# EAGLE design Robotics Booster Pack (EAGLE 6.5.0)
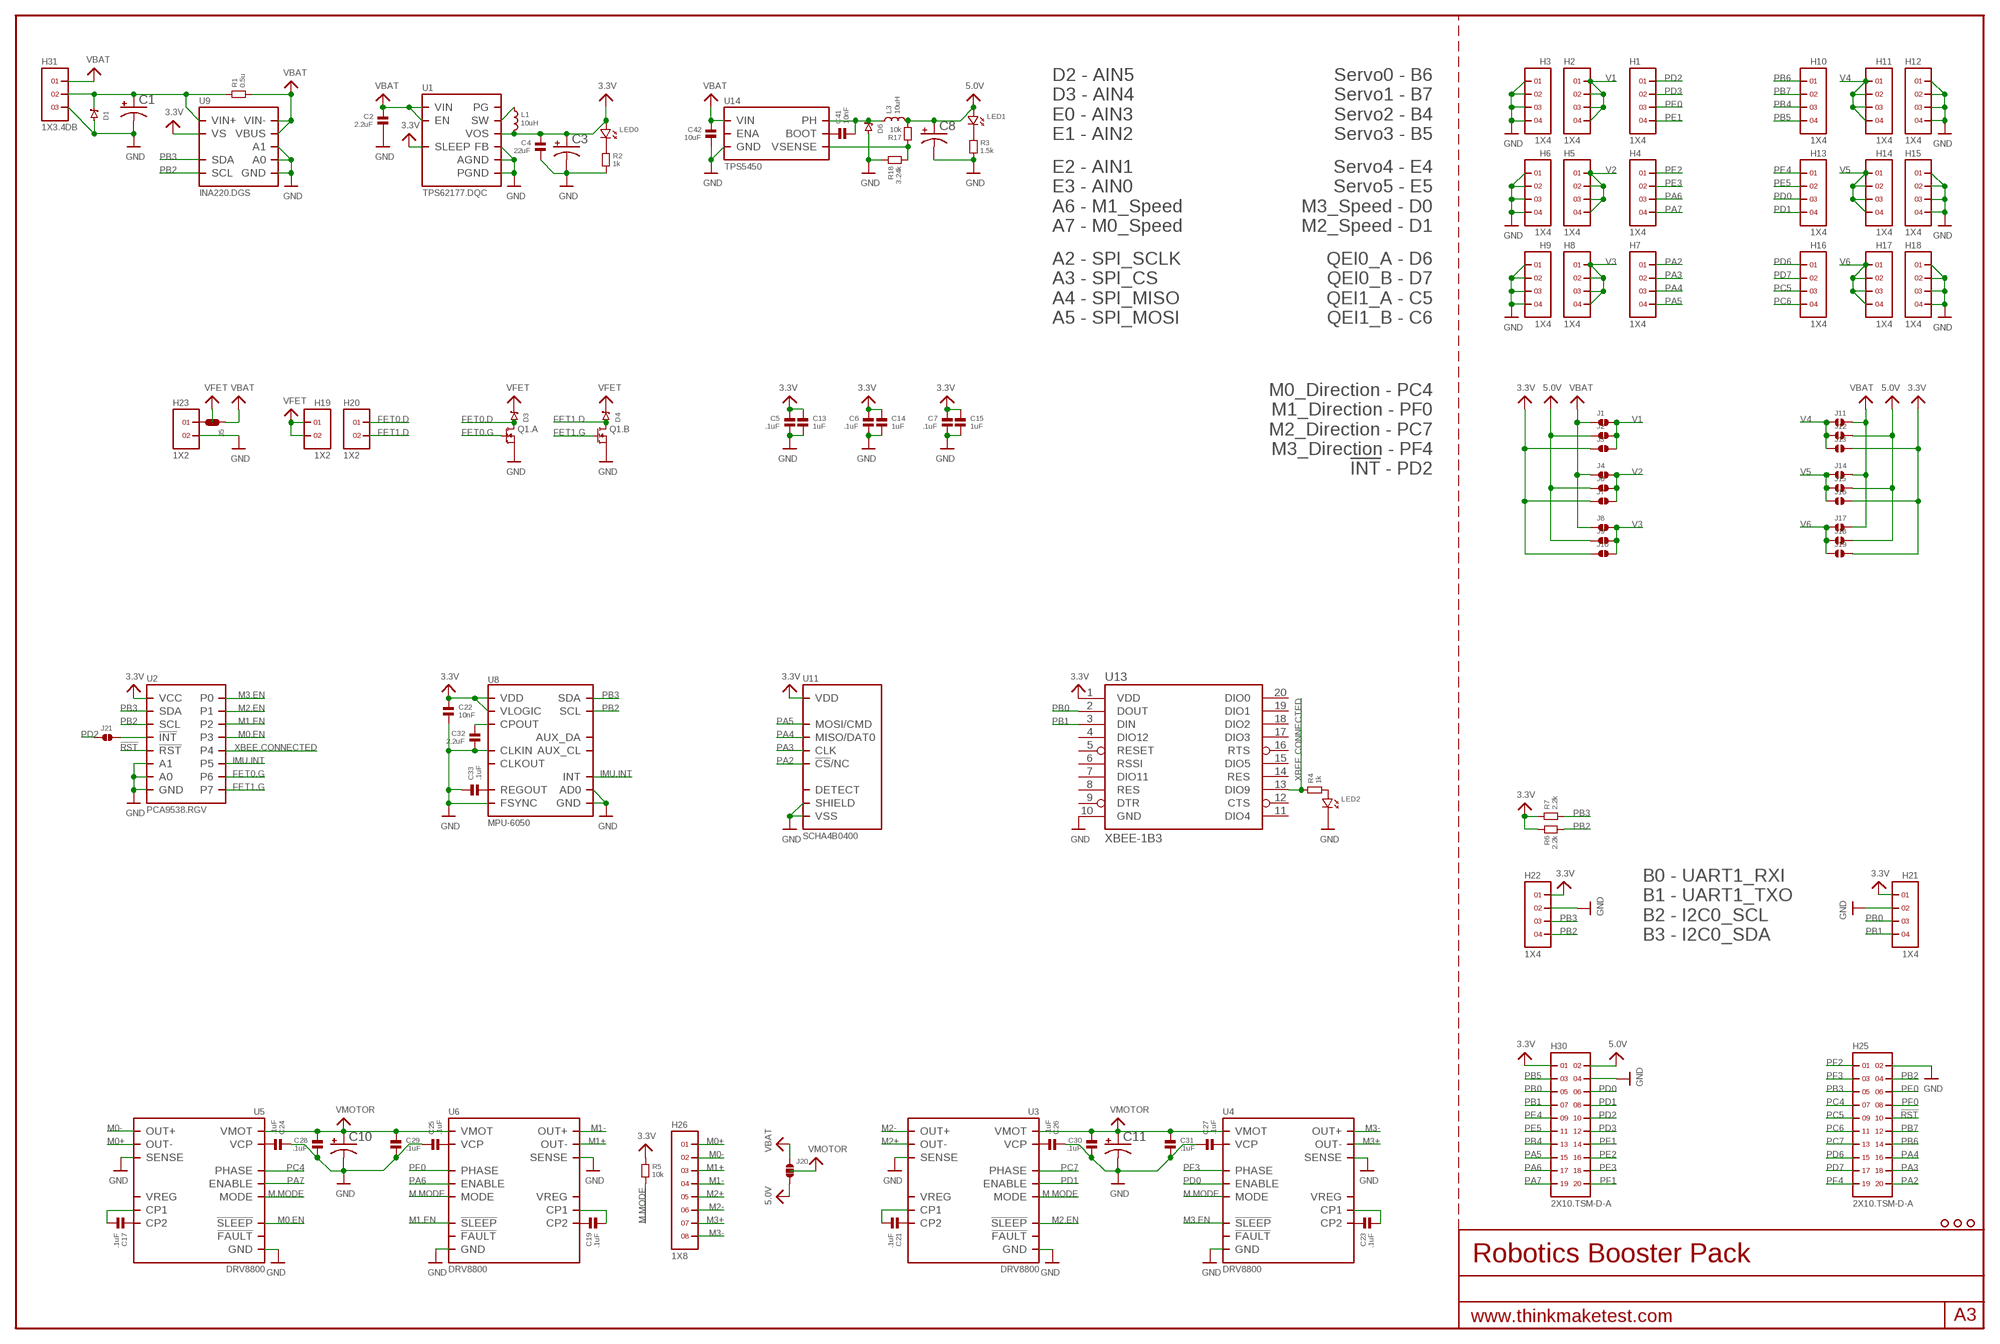
[diagram p0: schematic, sheet 1]

## Parts
C1  CPOL-USE  [PANASONIC_E]
C2  2.2uF  CAPACITOR.0603  [0603]
C3  CPOL-USE  [PANASONIC_E]
C4  22uF  CAPACITOR.0805  [0805]
C5  .1uF  CAPACITOR.0603  [0603]
C6  .1uF  CAPACITOR.0603  [0603]
C7  .1uF  CAPACITOR.0603  [0603]
C8  CPOL-USE  [PANASONIC_E]
C10  CPOL-USE  [PANASONIC_E]
C11  CPOL-USE  [PANASONIC_E]
C13  1uF  CAPACITOR.0603  [0603]
C14  1uF  CAPACITOR.0603  [0603]
C15  1uF  CAPACITOR.0603  [0603]
C17  .1uF  CAPACITOR.0603  [0603]
C19  .1uF  CAPACITOR.0603  [0603]
C21  .1uF  CAPACITOR.0603  [0603]
C22  10nF  CAPACITOR.0603  [0603]
C23  .1uF  CAPACITOR.0603  [0603]
C24  .1uF  CAPACITOR.0603  [0603]
C25  .1uF  CAPACITOR.0603  [0603]
C26  .1uF  CAPACITOR.0603  [0603]
C27  .1uF  CAPACITOR.0603  [0603]
C28  .1uF  CAPACITOR.0603  [0603]
C29  .1uF  CAPACITOR.0603  [0603]
C30  .1uF  CAPACITOR.0603  [0603]
C31  .1uF  CAPACITOR.0603  [0603]
C32  2.2uF  CAPACITOR.0603  [0603]
C33  .1uF  CAPACITOR.0603  [0603]
C41  10nF  CAPACITOR.0603  [0603]
C42  10uF  CAPACITOR.1206  [1206]
D1  CDBMT2100-HF  CDBMT____-HF  [SOD-123H]
D3  CDBMT2100-HF  CDBMT____-HF  [SOD-123H]
D4  CDBMT2100-HF  CDBMT____-HF  [SOD-123H]
D6  CDBC5XXX-G  [DO-214AB]
H1  1X4  [1X4]
H2  1X4  [1X4]
H3  1X4  [1X4]
H4  1X4  [1X4]
H5  1X4  [1X4]
H6  1X4  [1X4]
H7  1X4  [1X4]
H8  1X4  [1X4]
H9  1X4  [1X4]
H10  1X4  [1X4]
H11  1X4  [1X4]
H12  1X4  [1X4]
H13  1X4  [1X4]
H14  1X4  [1X4]
H15  1X4  [1X4]
H16  1X4  [1X4]
H17  1X4  [1X4]
H18  1X4  [1X4]
H19  1X2  [1X2]
H20  1X2  [1X2]
H21  1X4  [1X4]
H22  1X4  [1X4]
H23  1X2  [1X2]
H25  2X10.TSM-D-A  [TSM-110-XX-XXX-DV-A]
H26  1X8  [1824480000]
H30  2X10.TSM-D-A  [TSM-110-XX-XXX-DV-A]
H31  1X3.4DB  [4DB-P108-02]
J1  SOLDERJUMPER.2.LRG  [2.LRG]
J2  SOLDERJUMPER.2.LRG  [2.LRG]
J3  SOLDERJUMPER.2.LRG.PASTE  [2.LRG.PASTE]
J4  SOLDERJUMPER.2.LRG  [2.LRG]
J5  SOLDERJUMPER.3.LRG.12  [3.LRG.12]
J6  SOLDERJUMPER.2.LRG  [2.LRG]
J7  SOLDERJUMPER.2.LRG.PASTE  [2.LRG.PASTE]
J8  SOLDERJUMPER.2.LRG  [2.LRG]
J9  SOLDERJUMPER.2.LRG  [2.LRG]
J10  SOLDERJUMPER.2.LRG.PASTE  [2.LRG.PASTE]
J11  SOLDERJUMPER.2.LRG  [2.LRG]
J12  SOLDERJUMPER.2.LRG.PASTE  [2.LRG.PASTE]
J13  SOLDERJUMPER.2.LRG  [2.LRG]
J14  SOLDERJUMPER.2.LRG  [2.LRG]
J15  SOLDERJUMPER.2.LRG  [2.LRG]
J16  SOLDERJUMPER.2.LRG.PASTE  [2.LRG.PASTE]
J17  SOLDERJUMPER.2.LRG  [2.LRG]
J18  SOLDERJUMPER.2.LRG  [2.LRG]
J19  SOLDERJUMPER.2.LRG.PASTE  [2.LRG.PASTE]
J20  SOLDERJUMPER.3.LRG.12  [3.LRG.12]
J21  SOLDERJUMPER.2.LRG  [2.LRG]
L1  10uH  INDUCTOR-SRN6045  [SRN6045]
L3  10uH  INDUCTOR.XAL6060  [XAL6060]
LED0  LED.0603  [0603.LED]
LED1  LED.0603  [0603.LED]
LED2  LED.0603  [0603.LED]
Q1  FDMA  [MICROFET.2X2]
R1  0.5u  RESISTOR.2512  [2512]
R2  1k  RESISTOR.0603  [0603]
R3  1.5k  RESISTOR.0603  [0603]
R4  1k  RESISTOR.0603  [0603]
R5  10k  RESISTOR.0603  [0603]
R6  2.2k  RESISTOR.0603  [0603]
R7  2.2k  RESISTOR.0603  [0603]
R17  10k  RESISTOR.0603  [0603]
R18  3.24k  RESISTOR.0603  [0603]
U1  TPS62177.DQC  [DQC]
U2  PCA9538.RGV  [RGV.16]
U3  DRV8800  DRV8800.RTY  [RTY.16]
U4  DRV8800  DRV8800.RTY  [RTY.16]
U5  DRV8800  DRV8800.RTY  [RTY.16]
U6  DRV8800  DRV8800.RTY  [RTY.16]
U8  MPU-6050  [QFN.24.4X4]
U9  INA220.DGS  [DGS.10]
U11  SCHA4B0400  [SCHA4B0400]
U13  XBEE-1B3  [XBEE-SMD]
U14  TPS5450  TPS54X0  [DDA]
U$3  HOLE.4MM  [#4]
U$4  HOLE.4MM  [#4]
U$21  HOLE.4MM  [#4]

## Nets
3.3V: C3.+ C4.1 C5.1 C6.1 C7.1 C13.1 C14.1 C15.1 C22.1 H21.1 H22.1 H30.1 J3.1 J7.1 J10.1 J13.1 J16.1 J19.1 L1.2 LED0.P$1 R5.1 R6.1 R7.1 U1.8(SLEEP) U1.10(VOS) U2.14(VCC) U8.8(VLOGIC) U8.13(VDD) U9.6(VS) U11.VDD U13.1(VDD)
5.0V: C8.+ H30.2 J2.1 J6.1 J9.1 J12.1 J15.1 J18.1 J20.3 L3.2 LED1.P$1 R17.2
!RST: H25.10 U2.1(!RST)
FET0.D: D3.2 H20.1 Q1.6(.A:D) Q1.PAD@1(.A:D)
FET0.G: Q1.2(.A:G) U2.9(P6)
FET1.D: D4.2 H20.2 Q1.3(.B:D) Q1.PAD@2(.B:D)
FET1.G: Q1.5(.B:G) U2.10(P7)
GND: C1.- C2.2 C3.- C4.2 C5.2 C6.2 C7.2 C8.- C10.- C11.- C13.2 C14.2 C15.2 C22.2 C24.1 C25.1 C26.1 C27.1 C28.2 C29.2 C30.2 C31.2 C32.2 C33.1 C42.2 D1.2 D6.2 H3.1 H3.2 H3.3 H3.4 H6.1 H6.2 H6.3 H6.4 H9.1 H9.2 H9.3 H9.4 H12.1 H12.2 H12.3 H12.4 H15.1 H15.2 H15.3 H15.4 H18.1 H18.2 H18.3 H18.4 H21.2 H22.2 H23.2 H25.2 H30.4 H31.3 LED2.P$2 Q1.1(.A:S) Q1.4(.B:S) R2.2 R3.2 R18.1 U1.1(PGND) U1.5(FB) U1.6(AGND) U1.PAD(PGND) U2.6(GND) U2.15(A0) U2.16(A1) U2.PAD(GND) U3.2(GND) U3.7(SENSE) U3.12(GND) U3.PAD(GND) U4.2(GND) U4.7(SENSE) U4.12(GND) U4.PAD(GND) U5.2(GND) U5.7(SENSE) U5.12(GND) U5.PAD(GND) U6.2(GND) U6.7(SENSE) U6.12(GND) U6.PAD(GND) U8.1(CLKIN) U8.9(AD0) U8.11(FSYNC) U8.18(GND) U9.1(A1) U9.2(A0) U9.7(GND) U11.GND(VSS) U11.GND@1(VSS) U11.GND@2(VSS) U11.SHIELD U11.SHIELD@1(SHIELD) U11.SHIELD@2(SHIELD) U11.SHIELD@3(SHIELD) U11.VSS U13.10(GND) U14.6(GND) U14.PAD(GND)
IMU.INT: U2.8(P5) U8.12(INT)
M0+: H26.1@1 H26.1@2 U5.9(OUT-)
M0-: H26.2@1 H26.2@2 U5.6(OUT+)
M0.EN: U2.5(P3) U5.3(!SLEEP)
M1+: H26.3@1 H26.3@2 U6.9(OUT-)
M1-: H26.4@1 H26.4@2 U6.6(OUT+)
M1.EN: U2.4(P2) U6.3(!SLEEP)
M2+: H26.5@1 H26.5@2 U3.9(OUT-)
M2-: H26.6@1 H26.6@2 U3.6(OUT+)
M2.EN: U2.3(P1) U3.3(!SLEEP)
M3+: H26.7@1 H26.7@2 U4.9(OUT-)
M3-: H26.8@1 H26.8@2 U4.6(OUT+)
M3.EN: U2.2(P0) U4.3(!SLEEP)
M.MODE: R5.2 U3.16(MODE) U4.16(MODE) U5.16(MODE) U6.16(MODE)
N$1: L1.1 U1.9(SW)
N$2: LED0.P$2 R2.1
N$3: LED1.P$2 R3.1
N$4: LED2.P$1 R4.2
N$5: H23.1 J5.3
N$7: C33.2 U8.10(REGOUT)
N$8: J21.2 U2.11(!INT)
N$13: C17.1 U5.11(CP2)
N$18: C24.2 U5.13(VCP)
N$19: C25.2 U6.13(VCP)
N$20: C26.2 U3.13(VCP)
N$21: C27.2 U4.13(VCP)
N$22: C1.+ D1.1 H31.2 R1.1 U9.10(VIN+)
N$24: C32.1 U8.20(CPOUT)
N$25: C19.1 U6.11(CP2)
N$27: C21.1 U3.11(CP2)
N$29: C23.1 U4.11(CP2)
N$33: C41.1 U14.1(BOOT)
N$34: C41.2 D6.1 L3.1 U14.8(PH)
N$35: R17.1 R18.2 U14.4(VSENSE)
N$37: C21.2 U3.10(CP1)
N$38: C17.2 U5.10(CP1)
N$39: C19.2 U6.10(CP1)
N$40: C23.2 U4.10(CP1)
PA2: H7.1 H25.20 U11.!CS!/NC/DAT3(!CS!/NC)
PA3: H7.2 H25.18 U11.CLK
PA4: H7.3 H25.16 U11.MISO/DAT0
PA5: H7.4 H30.15 U11.MOSI/CMD
PA6: H4.3 H30.17 U6.4(ENABLE)
PA7: H4.4 H30.19 U5.4(ENABLE)
PB0: H21.3 H30.5 U13.2(DOUT)
PB1: H21.4 H30.7 U13.3(DIN)
PB2: H22.4 H25.4 R6.2 U2.12(SCL) U8.23(SCL) U9.5(SCL)
PB3: H22.3 H25.5 R7.2 U2.13(SDA) U8.24(SDA) U9.4(SDA)
PB4: H10.3 H30.13
PB5: H10.4 H30.3
PB6: H10.1 H25.14
PB7: H10.2 H25.12
PC4: H25.7 U5.1(PHASE)
PC5: H16.3 H25.9
PC6: H16.4 H25.11
PC7: H25.13 U3.1(PHASE)
PD0: H13.3 H30.6 U4.4(ENABLE)
PD1: H13.4 H30.8 U3.4(ENABLE)
PD2: H1.1 H30.10 J21.1
PD3: H1.2 H30.12
PD6: H16.1 H25.15
PD7: H16.2 H25.17
PE0: H1.3 H25.6
PE1: H1.4 H30.14
PE2: H4.1 H30.16
PE3: H4.2 H30.18
PE4: H13.1 H30.9
PE5: H13.2 H30.11
PF0: H25.8 U6.1(PHASE)
PF1: H30.20
PF2: H25.1
PF3: H25.3 U4.1(PHASE)
PF4: H25.19
V1: H2.1 H2.2 H2.3 H2.4 J1.2 J2.2 J3.2
V2: H5.1 H5.2 H5.3 H5.4 J4.2 J6.2 J7.2
V3: H8.1 H8.2 H8.3 H8.4 J8.2 J9.2 J10.2
V4: H11.1 H11.2 H11.3 H11.4 J11.2 J12.2 J13.2
V5: H14.1 H14.2 H14.3 H14.4 J14.2 J15.2 J16.2
V6: H17.1 H17.2 H17.3 H17.4 J17.2 J18.2 J19.2
VBAT: C2.1 C42.1 H31.1 J1.1 J4.1 J5.1 J8.1 J11.1 J14.1 J17.1 J20.1 R1.2 U1.2(VIN) U1.3(EN) U9.8(VBUS) U9.9(VIN-) U14.7(VIN)
VFET: D3.1 D4.1 H19.1 H19.2 J5.2
VMOTOR: C10.+ C11.+ C28.1 C29.1 C30.1 C31.1 J20.2 U3.8(VMOT) U4.8(VMOT) U5.8(VMOT) U6.8(VMOT)
XBEE.CONNECTED: R4.1 U2.7(P4) U13.13(DIO9)
Unconnected: U1.7(PG) U3.14(VREG) U3.15(!FAULT) U4.14(VREG) U4.15(!FAULT) U5.14(VREG) U5.15(!FAULT) U6.14(VREG) U6.15(!FAULT) U8.6(AUX_DA) U8.7(AUX_CL) U8.22(CLKOUT) U11.CD(DETECT) U13.4(DIO12) U13.5(RESET) U13.6(RSSI) U13.7(DIO11) U13.8(RES) U13.9(DTR) U13.11(DIO4) U13.12(CTS) U13.14(RES) U13.15(DIO5) U13.16(RTS) U13.17(DIO3) U13.18(DIO2) U13.19(DIO1) U13.20(DIO0) U14.5(ENA)

## Notes on the sheet
- D2 - AIN5
  D3 - AIN4
  E0 - AIN3
  E1 - AIN2
- Servo0 - B6
  Servo1 - B7
  Servo2 - B4
  Servo3 - B5
- E2 - AIN1
  E3 - AIN0
  A6 - M1_Speed
  A7 - M0_Speed
- Servo4 - E4
  Servo5 - E5
  M3_Speed - D0
  M2_Speed - D1
- A2 - SPI_SCLK
  A3 - SPI_CS
  A4 - SPI_MISO
  A5 - SPI_MOSI
- QEI0_A - D6
  QEI0_B - D7
  QEI1_A - C5
  QEI1_B - C6
- M0_Direction - PC4
  M1_Direction - PF0
  M2_Direction - PC7
  M3_Direction - PF4
  !INT! - PD2
- B0 - UART1_RXI
  B1 - UART1_TXO
  B2 - I2C0_SCL
  B3 - I2C0_SDA

## Library data of the parts
C1 C3 C8 C10 C11 = adafruit:CPOL-US: POLARIZED CAPACITOR, American symbol
C2 C4-C7 C13-C15 C17 C19 C21-C33 C41 C42 = standardparts:CAPACITOR
D1 D3 D4 = comchip:CDBMT____-HF
D6 = comchip:CDBC5XXX-G
H1-H18 H21 H22 = headers(.1in):1X4
H19 H20 H23 = headers(.1in):1X2
H25 H30 = headers(.1in)(samtec):2X10
H26 = weidmuller:1X8
H31 = te-connectivity:1X3
J1-J4 J6-J19 J21 = solderjumper:SOLDERJUMPER.2
J5 J20 = solderjumper:SOLDERJUMPER.3
L1 = bourns:INDUCTOR
L3 = coilcraft:INDUCTOR
LED0 LED1 LED2 = standardparts:LED
Q1 = fairchild:FDMA
R1 = tt-electronics:RESISTOR
R2-R7 R17 R18 = standardparts:RESISTOR
U1 = packages(ti):TPS62177
U2 = packages(ti):PCA9538
U3-U6 = packages(ti):DRV8800
U8 = invensense:MPU-6050
U9 = packages(ti):INA220
U11 = alps:SCHA4B0400
U13 = SparkFun-RF:XBEE-1: Xbee module footprints SMT header is CONN-09042.; PROD_ID: CONN-09042
U14 = packages(ti):TPS54X0
U$3 U$4 U$21 = screw_holes:HOLE

## Board
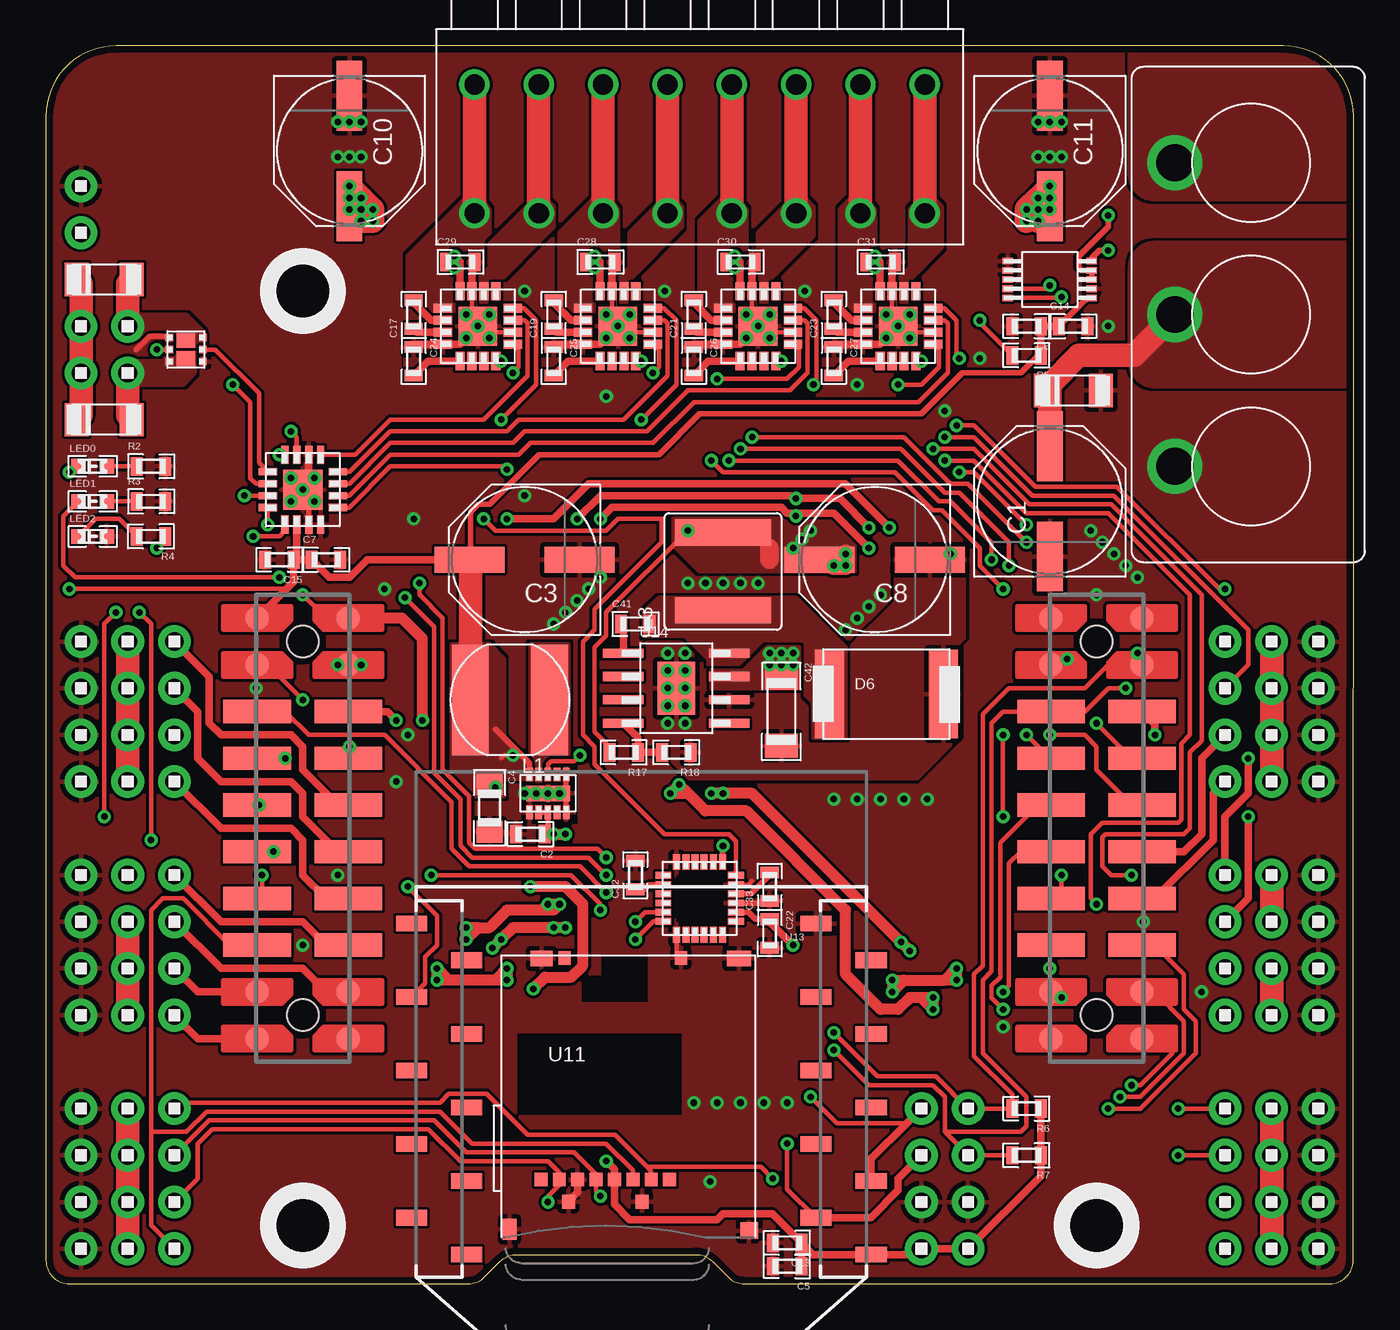
[diagram p1: board, top side]
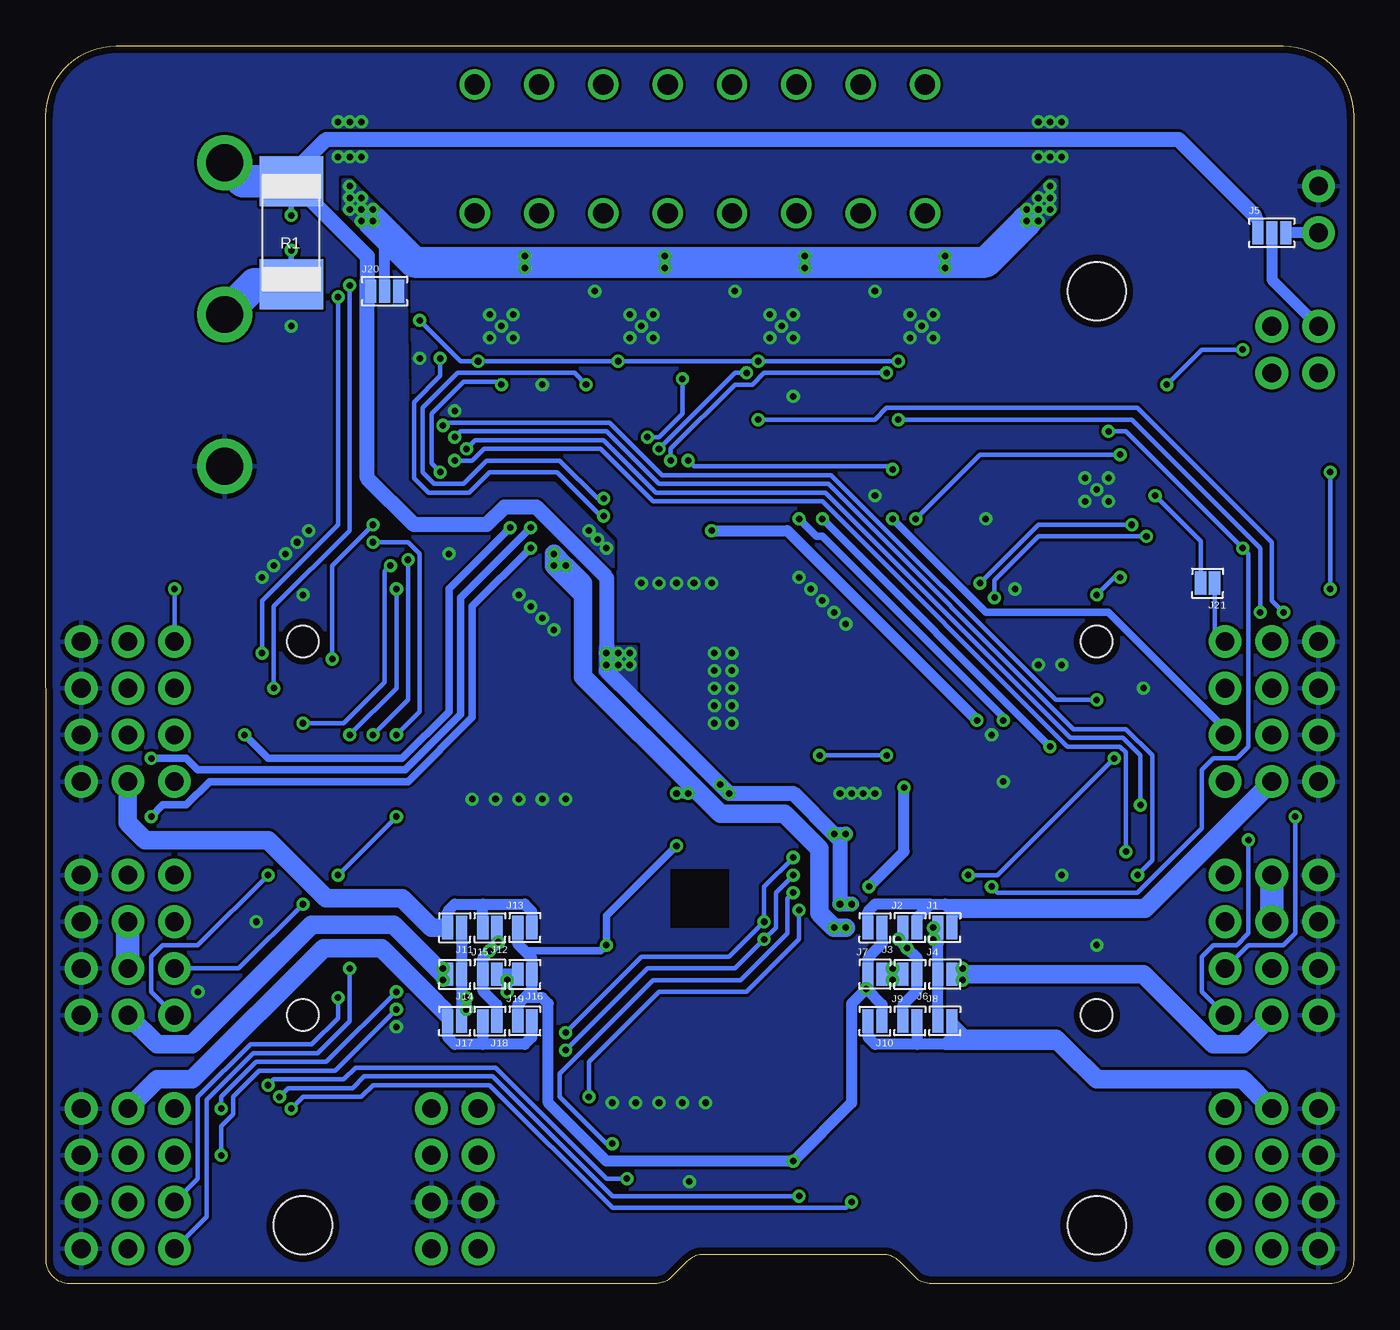
[diagram p2: board, bottom side, seen from below]

Size 71.13 x 67.31 mm. Coordinates in mm from the lower left corner, seen from the top.
Outline: 71.12,1.26 71.13,63.51 arc90 67.32,67.31 3.81,67.31 arc91 0,63.5 0,1.27 arc90 1.27,0 22.97,0 arc45 23.87,0.37 24.71,1.22 arc-45 25.61,1.59 35.35,1.59 arc-45 36.25,1.22 37.09,0.37 arc45 37.99,0 69.85,0 arc90 71.12,1.26
Copper layers (1*16): Top 0.0356mm / dielectric 1.5011mm / Bottom 0.0356mm
Design rules "OSHPark": minimum track width 6mil, minimum drill 13mil, track to track 6mil, track to pad 6mil, pad to pad 6mil, via to via 6mil, smd to smd 6mil, copper to edge 15mil, drill to drill 6mil, minimum pad ring 7mil, minimum via ring 7mil, stop-mask expansion 4mil, vias tented up to drill 16mil, thermal gap 10mil
tKeepout: 1 lines
tRestrict: area 34.3,19.7 to 36.8,22.2; 13 lines
bRestrict: area 34,19.4 to 37.1,22.5

### Footprints (pad centres in the part's own frame; a part is rotated, then mirrored left to right if it is on the bottom)
PANASONIC_E = smd 3.8 x 1.4: + 3,0; - -3,0
0603 = smd 0.65 x 1: 1 -0.775,0; 2 0.775,0
0805 = smd 1.2 x 1.4: 1 -1.3,0; 2 1.3,0
1206 = smd 1.3 x 1.8: 1 -1.85,0; 2 1.85,0
SOD-123H = smd 1.3 x 1.8: 1 -1.5,0; 2 1.5,0
DO-214AB = smd 1.6 x 4.8: 1 -3.1,0; 2 3.1,0
1X4 = drill 1.016 pad 1.778: 1 0,0; 2 2.54,0; 3 5.08,0; 4 7.62,0
1X2 = drill 1.016 pad 1.778: 1 0,0; 2 2.54,0
TSM-110-XX-XXX-DV-A = smd 1.27 x 1.27: 1 -11.43,-2.477; 2 -11.43,2.477; 3 -8.89,-2.477; 4 -8.89,2.477; 17 8.89,-2.477; 18 8.89,2.477; 19 11.43,-2.477; 20 11.43,2.477 | smd 1.27 x 3.683: 5 -6.35,-2.477; 6 -6.35,2.477; 7 -3.81,-2.477; 8 -3.81,2.477; 9 -1.27,-2.477; 10 -1.27,2.477; 11 1.27,-2.477; 12 1.27,2.477; 13 3.81,-2.477; 14 3.81,2.477; 15 6.35,-2.477; 16 6.35,2.477 | hole 1.727: -10.16,0; 10.16,0
1824480000 = drill 1.1: 1@1 -12.25,8.7; 1@2 -12.25,1.7; 2@1 -8.75,8.7; 2@2 -8.75,1.7; 3@1 -5.25,8.7; 3@2 -5.25,1.7; 4@1 -1.75,8.7; 4@2 -1.75,1.7; 5@1 1.75,8.7; 5@2 1.75,1.7; 6@1 5.25,8.7; 6@2 5.25,1.7; 7@1 8.75,8.7; 7@2 8.75,1.7; 8@1 12.25,8.7; 8@2 12.25,1.7
4DB-P108-02 = drill 2: 1 -8.255,2.362; 2 0,2.362; 3 8.255,2.362
2.LRG = smd 0.61 x 1.27: 1 -0.381,0; 2 0.381,0
2.LRG.PASTE = smd 0.61 x 1.27: 1 -0.381,0; 2 0.381,0
3.LRG.12 = smd 0.61 x 1.27: 1 -0.762,0; 2 0,0; 3 0.762,0
SRN6045 = smd 2 x 6: 1 -2.15,0; 2 2.15,0
XAL6060 = smd 1.43 x 5.24: 1 -2.11,0; 2 2.11,0
0603.LED = smd 0.8 x 0.8: P$1 -0.775,0; P$2 0.775,0
MICROFET.2X2 = smd 0.42 x 0.42: 1 -0.65,-0.915; 2 0,-0.915; 3 0.65,-0.915; 4 0.65,0.915; 5 0,0.915; 6 -0.65,0.915 | smd 0.8 x 1: PAD@1 -0.5,0; PAD@2 0.5,0
2512 = smd 2.7 x 3.45: 1 -2.8,0; 2 2.8,0
DQC = smd 0.75 x 0.37: 1 -1.025,1; 2 -1.025,0.5; 3 -1.025,0; 4 -1.025,-0.5; 5 -1.025,-1; 6 1.025,-1; 7 1.025,-0.5; 8 1.025,0; 9 1.025,0.5; 10 1.025,1 | smd 0.84 x 2.4: PAD 0,0
RGV.16 = smd 1 x 0.4: 1 -1.9,0.975; 2 -1.9,0.325; 3 -1.9,-0.325; 4 -1.9,-0.975; 9 1.9,-0.975; 10 1.9,-0.325; 11 1.9,0.325; 12 1.9,0.975 | smd 0.4 x 1: 5 -0.975,-1.9; 6 -0.325,-1.9; 7 0.325,-1.9; 8 0.975,-1.9; 13 0.975,1.9; 14 0.325,1.9; 15 -0.325,1.9; 16 -0.975,1.9 | smd 2.16 x 2.16: PAD 0,0
RTY.16 = smd 1 x 0.5: 1 -1.9,0.975; 2 -1.9,0.325; 3 -1.9,-0.325; 4 -1.9,-0.975; 9 1.9,-0.975; 10 1.9,-0.325; 11 1.9,0.325; 12 1.9,0.975 | smd 0.5 x 1: 5 -0.975,-1.9; 6 -0.325,-1.9; 7 0.325,-1.9; 8 0.975,-1.9; 13 0.975,1.9; 14 0.325,1.9; 15 -0.325,1.9; 16 -0.975,1.9 | smd 2.1 x 2.1: PAD 0,0
QFN.24.4X4 = smd 0.85 x 0.38: 1 -1.975,1.25; 2 -1.975,0.75; 3 -1.975,0.25; 4 -1.975,-0.25; 5 -1.975,-0.75; 6 -1.975,-1.25; 13 1.975,-1.25; 14 1.975,-0.75; 15 1.975,-0.25; 16 1.975,0.25; 17 1.975,0.75; 18 1.975,1.25 | smd 0.38 x 0.85: 7 -1.25,-1.975; 8 -0.75,-1.975; 9 -0.25,-1.975; 10 0.25,-1.975; 11 0.75,-1.975; 12 1.25,-1.975; 19 1.25,1.975; 20 0.75,1.975; 21 0.25,1.975; 22 -0.25,1.975; 23 -0.75,1.975; 24 -1.25,1.975
DGS.10 = smd 0.36 x 0.57: 1 -1,-2.285; 2 -0.5,-2.285; 3 0,-2.285; 4 0.5,-2.285; 5 1,-2.285; 6 1,2.285; 7 0.5,2.285; 8 0,2.285; 9 -0.5,2.285; 10 -1,2.285
SCHA4B0400 = smd 0.7 x 0.75: !CS!/NC/DAT3 8.162,3.125; CLK 5.162,3.125; GND 3.663,1.925; GND@1 7.662,1.925; MISO/DAT0 3.163,3.125; MOSI/CMD 7.162,3.125; NC/NC/DAT1 2.163,3.125; NC/NC/DAT2 9.162,3.125; VDD 6.162,3.125; VSS 4.162,3.125 | smd 0.65 x 0.75: CD 3.438,15.175; GND@2 9.787,15.175 | smd 0.745 x 1.15: SHIELD 0.453,0.425 | smd 0.95 x 0.9: SHIELD@1 13.488,0.35 | smd 1.3 x 0.85: SHIELD@2 12.925,15.15 | smd 1.2 x 0.85: SHIELD@3 2.2,15.15
XBEE-SMD = smd 1.7 x 0.85: 1 -12.5,20; 2 -9.5,18; 3 -12.5,16; 4 -9.5,14; 5 -12.5,12; 6 -9.5,10; 7 -12.5,8; 8 -9.5,6; 9 -12.5,4; 10 -9.5,2; 11 12.5,2; 12 9.5,4; 13 12.5,6; 14 9.5,8; 15 12.5,10; 16 9.5,12; 17 12.5,14; 18 9.5,16; 19 12.5,18; 20 9.5,20
DDA = smd 2.2 x 0.5: 1 -2.875,1.905; 2 -2.875,0.635; 3 -2.875,-0.635; 4 -2.875,-1.905; 5 2.875,-1.905; 6 2.875,-0.635; 7 2.875,0.635; 8 2.875,1.905 | smd 2.05 x 2.875: PAD 0,0
#4 = hole 3.175: 0,0

### Placement (x,y rotation side)
C1  54.61,42.55 90 top
C2  26.35,24.45 180 top
C3  26.04,39.37 180 top
C4  24.13,25.88 270 top
C5  40.32,0.95 180 top
C6  53.34,52.07 180 top
C7  15.24,39.37 0 top
C8  45.09,39.37 180 top
C10  16.51,61.59 270 top
C11  54.61,61.59 270 top
C13  40.32,2.22 180 top
C14  55.88,52.07 0 top
C15  12.7,39.37 180 top
C17  20,52.7 90 top
C19  27.62,52.7 90 top
C21  35.24,52.7 90 top
C22  39.37,19.05 270 top
C23  42.86,52.7 90 top
C24  20,50.16 270 top
C25  27.62,50.16 270 top
C26  35.24,50.16 270 top
C27  42.86,50.16 270 top
C28  30.16,55.56 0 top
C29  22.54,55.56 0 top
C30  37.78,55.56 0 top
C31  45.4,55.56 0 top
C32  32.07,22.23 90 top
C33  39.37,21.59 90 top
C41  32.07,35.88 0 top
C42  40.01,31.11 270 top
D1  55.88,48.58 0 top
D3  3.17,46.99 0 top
D4  3.17,54.61 0 top
D6  45.72,32.07 0 top
H1  6.99,34.92 270 top
H2  4.45,34.92 270 top
H3  1.91,34.92 270 top
H4  6.99,22.23 270 top
H5  4.45,22.23 270 top
H6  1.91,22.23 270 top
H7  6.99,9.53 270 top
H8  4.45,9.53 270 top
H9  1.91,9.53 270 top
H10  64.14,27.3 90 top
H11  66.67,27.3 90 top
H12  69.22,27.3 90 top
H13  64.14,14.61 90 top
H14  66.67,14.61 90 top
H15  69.22,14.61 90 top
H16  64.14,1.91 90 top
H17  66.67,1.91 90 top
H18  69.22,1.91 90 top
H19  1.91,49.53 90 top
H20  4.45,49.53 90 top
H21  47.62,1.91 90 top
H22  50.16,1.91 90 top
H23  1.91,57.15 90 top
H25  57.15,24.77 270 top
H26  35.56,56.52 0 top
H30  13.97,24.77 270 top
H31  59.05,52.7 270 top
J1  22.23,19.37 0 bottom
J2  24.13,19.37 0 bottom
J3  26.04,19.37 180 bottom
J4  22.23,16.83 0 bottom
J5  4.45,57.15 0 bottom
J6  24.13,16.83 180 bottom
J7  26.04,16.83 0 bottom
J8  22.23,14.29 0 bottom
J9  24.13,14.29 0 bottom
J10  26.04,14.29 180 bottom
J11  48.9,19.37 180 bottom
J12  46.99,19.37 180 bottom
J13  45.09,19.37 0 bottom
J14  48.9,16.83 180 bottom
J15  46.99,16.83 0 bottom
J16  45.09,16.83 180 bottom
J17  48.9,14.29 180 bottom
J18  46.99,14.29 180 bottom
J19  45.09,14.29 0 bottom
J20  52.7,53.98 0 bottom
J21  7.94,38.1 180 bottom
L1  25.24,31.75 180 top
L3  36.83,38.73 90 top
LED0  2.54,44.45 0 top
LED1  2.54,42.55 0 top
LED2  2.54,40.64 0 top
Q1  7.62,50.8 90 top
R1  57.78,57.15 90 bottom
R2  5.71,44.45 0 top
R3  5.71,42.55 0 top
R4  5.71,40.64 180 top
R5  53.34,50.48 180 top
R6  53.34,9.53 180 top
R7  53.34,6.99 180 top
R17  31.43,28.89 180 top
R18  34.29,28.89 180 top
U1  27.3,26.67 90 top
U2  13.97,43.18 180 top
U3  38.73,52.07 180 top
U4  46.35,52.07 180 top
U5  23.5,52.07 180 top
U6  31.11,52.07 180 top
U8  35.56,20.95 90 top
U9  54.61,54.61 270 top
U11  24.77,2.54 0 top
U13  32.38,21.59 180 top
U14  34.29,32.38 0 top
U$3  13.97,3.17 0 top
U$4  57.15,3.17 0 top
U$21  13.97,53.98 0 top

### Tracks (layer width: path | path; a pad name or v marks a point on that pad's centre or on a via)
3.3V  (via drill 0.36)
  Top 0.254: U1.8 27.3,28.26 27.46,28.42 28.73,28.42 v29.05,28.73 | v25.4,28.73 24.92,28.73 24.77,28.57 | 13.04,37.75 13.01,37.78 v1.27,37.78 | v1.27,44.13 1.59,44.45 LED0.P$1
  Top 0.305: U9.6 56.65,53.61 C14.1 | U1.10 26.3,28.3 24.45,30.16 | 23.09,39.31 23.09,41.98 23.5,42.39 24.13,42.39 26.83,45.09 33.34,45.09 35.56,47.31 47.62,47.31 49.85,49.53 53.02,49.53 53.98,50.48 | U8.13 36.81,23.79 v36.83,23.81 | U8.8 38.22,20.2 38.59,19.82 C22.1
  Top 0.406: R6.1 R7.1 54.12,5.86 H22.1 H21.1 47.31,1.59 U13.1 41.73,1.59 C13.1 | v30.48,6.67 30.93,6.22 U11.VDD 30.93,4.32 31.75,3.49 36.51,3.49 36.83,3.81 39.51,3.81 C13.1 | C13.1 C5.1 | C15.1 13.47,38.18 13.04,37.75 H30.1 | U2.14 13.64,39.54 C15.1 | C15.1 C7.1 15.42,38.42 16.51,38.42 17.46,39.37 C3.+ | C14.1 C6.1 R5.1 53.98,50.48 | C22.1 39.37,19.68 v40.64,18.41
  Top 0.61: v26.51,16.03 27.15,16.67 28.57,16.67 29.21,17.3 29.21,20.64 28.26,21.59 v26.35,21.59 | v24.45,26.99 24.26,27.18 C4.1
  Top 1.27: C3.+ 23.09,39.31 L1.2
  Bottom 0.254: v29.05,28.73 v25.4,28.73 | v1.27,37.78 v1.27,44.13
  Bottom 0.406: 44.7,17.72 44.7,15.81 | v36.83,23.81 40.64,20 v40.64,18.41 40.96,18.1 45.09,18.1
  Bottom 0.61: J3.1 25.65,18.48 26.42,17.72 J7.1 26.42,15.94 v26.51,16.03 | v26.51,16.03 25.65,15.18 J10.1 | 45.09,15.56 44.7,15.94 J16.1 44.7,17.72 45.09,18.1 45.47,18.48 J13.1 | 45.09,15.56 45.47,15.18 J19.1 | v26.35,21.59 24.45,23.5 v24.45,26.99 | v26.51,16.03 27.3,15.24 27.3,9.84 v30.48,6.67 40.64,6.67 43.81,9.84 43.81,15.24 44.13,15.56 45.09,15.56
  pour Top (rank 2, no thermals): 22.07,34.77 24.13,34.77 24.92,33.97 24.92,29.53 26.35,28.1 26.35,27.46 24.92,27.46 24.92,26.51 23.34,26.51 22.07,27.78
5.0V  (via drill 0.36)
  Top 0.254: 34.49,40.84 L3.2 | v34.92,40.96 30.48,36.51 30.48,35.24 29.84,34.61 29.84,30.02 30.66,29.21 R17.2 | 16.45,36.45 14.99,36.45 v13.97,37.47 | v12.7,38.42 1.59,38.42 0.95,39.05 0.95,41.73 LED1.P$1
  Top 0.61: v24.29,18.26 v24.77,18.73 25.4,19.37 v28.26,19.37 | v46.99,18.1 v46.51,18.57 38.42,26.67 v36.83,26.67 v36.2,26.67 | v20.48,30.64 20.48,35.08 19.37,36.2 H30.2
  Top 1.016: 16.45,36.45 H30.2 | 39.37,39.37 39.37,40.01 | v43.5,39.05 v42.86,39.05 v43.5,39.69
  Bottom 0.254: v13.97,37.47 13.02,38.42 v12.7,38.42
  Bottom 0.61: v24.29,18.26 23.75,17.72 J6.1 23.75,15.94 24.51,15.18 J9.1 | J12.1 46.61,18.48 v46.51,18.57 v46.99,18.1 47.37,17.72 J15.1 47.37,15.94 46.61,15.18 J18.1 | v24.29,18.26 v24.77,18.73 | v24.29,18.26 24.51,18.48 J2.1 | 35.56,26.67 v36.2,26.67 v36.83,26.67 | v34.92,40.96 30.8,40.96 v20.48,30.64
  Bottom 1.016: 41.91,37.47 41.91,33.02 35.56,26.67 34.45,25.56 30.96,25.56 29.05,23.65 29.05,20.16 v28.26,19.37 v27.62,19.37 | 41.91,37.47 v43.5,39.05 | v42.86,39.05 v43.5,39.69 v43.5,39.05 | v43.5,39.05 v42.86,39.05 | v42.86,39.05 41.91,38.1 41.91,37.47
  other vias: 40.64,40.01 41.12,40.48 41.59,40.96
  pour Top (rank 2, no thermals): 34.13,41.59 42.55,41.59 43.97,40.16 43.97,38.73 35.56,38.73 34.13,40.16
  pour Bottom (rank 4, no thermals): 53.18,55.88 51.59,55.88 51.44,44.45 51.44,43.97 50.32,42.86 47.94,42.86 46.99,43.5 43.5,43.5 40.32,40.32 40.32,38.73 44.45,42.55 46.35,42.55 46.99,41.91 50.96,41.91 53.34,44.29 53.34,44.45
!RST  (via drill 0.36)
  Top 0.254: U2.1 16.49,42.2 18.73,44.45 24.92,44.45 v25.08,44.29 | v36.2,44.77 36.83,44.13 46.2,44.13 48.26,42.07 48.74,42.07 50.8,40.01 50.8,39.05 v52.07,37.78 | v54.61,29.84 56.52,29.84 57.15,29.21 57.15,27.94 59.05,26.04 H25.10
  Bottom 0.254: v25.08,44.29 25.24,44.45 35.88,44.45 v36.2,44.77 | v52.07,37.78 52.07,32.38 v54.61,29.84
FET0.D
  Top 1.27: H20.1 4.45,47.22 D3.2
  pour Top (rank 2, no thermals): 8.1,51.12 8.1,49.53 7.46,48.9 4.13,48.9 3.81,49.21 3.81,49.85 4.13,50.16 6.35,50.16 7.3,51.12
FET0.G
  Top 0.254: Q1.2 9.21,50.8 11.59,48.42 11.59,44.64 U2.9
FET1.D
  Top 1.27: H20.2 4.45,54.38 D4.2
  pour Top (no thermals): 4.13,52.7 7.62,52.7 8.57,51.75 8.57,51.28 8.33,51.04 6.99,51.04 6.99,51.75 5.4,51.75 5.08,51.44 4.13,51.44 3.81,51.75 3.81,52.39
FET1.G  (via drill 0.36)
  Top 0.254: U2.10 11.42,43.51 11.11,43.81 11.11,47.94 v10.16,48.9 | v6.03,50.8 Q1.5
  Bottom 0.254: v10.16,48.9 8.26,50.8 v6.03,50.8
GND  (via drill 0.36)
  Top 0.254: U5.2 23.82,51.74 U5.PAD 23.17,52.4 U5.7 | U6.2 31.44,51.74 U6.PAD 30.79,52.4 U6.7 | U3.2 39.06,51.74 U3.PAD 38.41,52.4 U3.7 | U4.2 46.68,51.74 U4.PAD 46.03,52.4 U4.7 | U8.1 34.31,17.96 U11.GND@2 | U8.11 38.22,21.7 38.42,21.91
  Top 0.305: U1.5 28.3,26.3 v27.94,26.67 28.3,27.04 U1.6 | U2.15 14.29,42.85 U2.PAD | U8.9 39.26,20.7 C33.1 | Q1.4 6.64,51.51 5.64,51.51 4.92,50.8
  Top 0.406: U6.PAD 30.14,51.09 U6.12 27.78,51.09 C25.1 | U5.PAD 22.52,51.09 U5.12 20.16,51.09 C24.1 | U4.PAD 45.38,51.09 U4.12 43.02,51.09 C27.1 | U3.PAD 37.76,51.09 U3.12 35.4,51.09 C26.1 | U11.VSS 28.93,4.96 U11.GND | U2.6 14.29,43.51 U2.PAD | U5.7 23.17,55.41 C29.2 | U6.7 30.79,55.41 C28.2 | U3.7 38.41,55.41 C30.2 | U4.7 46.03,55.41 C31.2
  other vias: 24.13,51.44 22.86,51.44 23.5,52.07 22.86,52.7 24.13,52.7 31.75,51.44 30.48,51.44 30.48,52.7 31.11,52.07 31.75,52.7 39.37,51.44 38.1,51.44 38.1,52.7 39.37,52.7 38.73,52.07 46.99,51.44 45.72,51.44 45.72,52.7 46.99,52.7 46.35,52.07 33.81,32.38 34.77,32.38 34.77,33.34 33.81,33.34 33.81,31.43 34.77,31.43 34.77,30.48 33.81,30.48 34.77,34.29 33.81,34.29 27.3,26.67 26.67,26.67 26.04,26.67 26.04,53.98 33.66,53.98 41.27,53.98 54.61,61.28 53.98,61.28 55.24,61.28 15.88,61.28 16.51,61.28 17.14,61.28 15.88,63.18 16.51,63.18 17.14,63.18 53.98,63.18 54.61,63.18 55.24,63.18 13.97,18.41 52.07,13.97 11.43,32.38 15.88,22.23 17.14,33.66 15.88,33.66 19.68,29.84 18.41,37.78 13.34,43.81 14.61,43.81 14.61,42.55 13.34,42.55 13.97,43.18 20,41.59 19.05,27.3 59.69,19.68 62.87,15.88 26.04,42.86 56.83,40.96 57.47,40.32 58.1,39.69 58.74,39.05 59.37,38.42 49.21,39.69 43.5,35.56 44.13,36.2 44.77,36.83 45.4,37.47 36.83,38.1 37.78,38.1 38.73,38.1 35.88,38.1 34.92,38.1 30.16,38.42 29.53,37.78 28.89,37.15 28.26,36.51 27.62,35.88 42.86,26.35 44.13,26.35 45.4,26.35 46.67,26.35 47.94,26.35 35.24,9.84 36.51,9.84 37.78,9.84 57.15,37.47 30.48,48.26 44.13,48.9 48.9,47.47 50.8,50.32 36.13,5.56 57.78,52.07 39.05,9.84 40.32,9.84
  pour Bottom (rank 6): 0,0 71.12,0 71.12,67.31 0,67.31
  pour Top (rank 6): 0,0 71.12,0 71.12,67.31 0,67.31
  pour Top (isolate 0.254, no thermals): 59.05,43.18 63.5,38.73 71.12,38.73 71.12,46.35 60.33,46.35 arc90 59.05,45.09
IMU.INT  (via drill 0.36)
  Top 0.254: U2.8 v12.7,45.09 | v23.81,41.59 24.45,40.96 30.48,40.96 31.11,41.59 33.5,41.59 33.5,40.32 29.84,36.67 29.84,35.56 29.21,34.92 29.21,29.84 29.84,29.21 29.84,28.26 33.66,24.45 37.15,24.45 37.53,24.06 U8.12
  Bottom 0.254: v12.7,45.09 20.32,45.09 v23.81,41.59
M0+
  Top 1.27: H26.1@1 H26.1@2
  pour Top (rank 3, no thermals): 22.23,53.34 24.13,55.24 24.13,58.42 23.65,59.05 22.86,59.05 19.68,55.88 19.68,54.13 20.95,52.86 22.23,52.86
M0-
  Top 1.27: H26.2@2 H26.2@1
  pour Top (no thermals): 24.13,55.24 24.13,56.52 26.67,59.05 27.15,59.05 27.62,58.58 27.62,57.47 24.13,53.98 24.13,53.34 23.5,53.34 23.5,54.61
M0.EN
  Top 0.254: U5.3 26.03,52.4 26.19,52.23 26.19,49.37 23.81,46.99 18.73,46.99 16.82,45.08 U2.5
M1+
  Top 1.27: H26.3@1 H26.3@2
  pour Top (rank 3, no thermals): 29.84,53.34 31.11,54.61 31.11,58.42 30.64,59.05 29.84,59.05 27.94,57.15 27.94,53.5 28.57,52.86 29.84,52.86
M1-
  Top 1.27: H26.4@2 H26.4@1
  pour Top (no thermals): 31.75,55.24 31.75,57.15 33.66,59.05 34.13,59.05 34.61,58.58 34.61,57.47 31.75,54.61 31.75,53.34 31.11,53.34 31.11,54.61
M1.EN
  Top 0.254: U6.3 33.65,52.4 33.81,52.23 33.81,49.37 31.43,46.99 25.72,46.99 25.08,46.35 18.73,46.35 16.53,44.16 U2.4
M2+
  Top 1.27: H26.5@1 H26.5@2
  pour Top (rank 3, no thermals): 37.47,53.34 38.1,53.98 38.1,58.42 37.62,59.05 36.83,59.05 35.56,57.78 35.56,53.5 36.2,52.86 37.47,52.86
M2-
  Top 1.27: H26.6@2 H26.6@1
  pour Top (no thermals): 38.73,53.34 38.73,57.15 40.64,59.05 41.27,59.05 41.75,58.58 41.75,56.99 39.37,54.61 39.37,53.34
M2.EN
  Top 0.254: U3.3 41.27,52.4 41.43,52.23 41.43,49.53 40.48,48.58 34.92,48.58 32.7,46.35 26.04,46.35 25.4,45.72 18.73,45.72 16.52,43.51 U2.3
M3+
  Top 1.27: H26.7@1 H26.7@2
  pour Top (rank 3, no thermals): 45.09,52.86 45.09,58.42 44.61,59.05 43.81,59.05 43.18,58.42 43.18,53.5 43.81,52.86
M3-
  Top 1.27: H26.8@1 H26.8@2
  pour Top (no thermals): 46.99,55.24 46.99,58.42 47.62,59.05 48.26,59.05 48.74,58.58 48.74,56.36 46.99,54.61 46.99,53.34 46.35,53.34 46.35,54.61
M3.EN
  Top 0.254: U4.3 48.89,52.4 49.05,52.23 49.05,49.53 47.47,47.94 35.24,47.94 33.02,45.72 26.35,45.72 25.72,45.09 18.73,45.09 16.5,42.85 U2.2
M.MODE  (via drill 0.36)
  Top 0.254: U5.16 v24.76,50.17 | v47.62,50.16 U4.16 | U6.16 v32.38,50.17 | U3.16 v40,50.17 | v50.8,52.39 50.8,52.25 R5.2
  Top 0.406: v24.76,50.17 v24.77,50.16 | U4.16 | v32.38,50.17 v32.38,50.16 | v40,50.17 v40.01,50.16
  Bottom 0.254: v24.77,50.16 v32.38,50.16 v40.01,50.16 v47.62,50.16 48.58,50.16 v50.8,52.39
N$1
  pour Top (no thermals): 26.67,27.3 26.67,28.57 26.35,28.89 26.35,34.77 28.42,34.77 28.42,28.73 28.26,28.57 27.3,28.57 26.99,28.26 26.99,27.3
N$2
  Top 0.254: LED0.P$2 R2.1
N$3
  Top 0.254: R3.1 LED1.P$2
N$4
  Top 0.254: LED2.P$1 2.72,41.59 3.99,41.59 R4.2
N$5
  Bottom 0.61: H23.1 J5.3
N$7
  Top 0.305: U8.10 38.35,21.2 39.37,22.23 C33.2
N$8  (via drill 0.36)
  Top 0.254: U2.11 12.06,42.86 v10.79,42.86
  Bottom 0.254: J21.2 8.32,40.39 v10.79,42.86
N$13
  Top 0.406: U5.11 20.19,51.74 C17.1
N$18
  Top 0.406: U5.13 20.78,50.17 C24.2
N$19
  Top 0.406: U6.13 28.4,50.17 C25.2
N$20
  Top 0.406: U3.13 36.02,50.17 C26.2
N$21
  Top 0.406: U4.13 43.64,50.17 C27.2
N$22  (via drill 0.36)
  Top 0.305: v57.78,56.2 57.31,56.2 56.9,55.78 U9.10
  Top 1.27: 54.61,48.35 54.61,48.9 56.2,50.48 59.2,50.48 H31.2 | 54.61,48.35 D1.1 | 54.61,48.35 C1.+
  Bottom 0.305: v57.78,56.2 R1.1
  Bottom 1.778: R1.1 59.77,54.35 H31.2
  pour Top (no thermals): 71.12,56.52 60.33,56.52 arc90 59.05,55.24 59.05,50.16 arc90 60.33,48.9 71.12,48.9
N$24
  Top 0.305: U8.20 32.82,21.7 32.56,21.45 C32.1
N$25
  Top 0.406: U6.11 27.81,51.74 C19.1
N$27
  Top 0.406: U3.11 35.43,51.74 C21.1
N$29
  Top 0.406: U4.11 43.05,51.74 C23.1
N$33
  Top 0.406: C41.1 31.41,35.76 U14.1
N$34
  pour Top (rank 2, no thermals): 32.54,36.51 33.34,37.31 40.8,37.31 43.5,34.61 43.5,29.69 41.75,29.69 41.75,31.59 39.85,33.5 36.04,33.5 36.04,33.97 34.77,35.24 32.54,35.24
N$35
  Top 0.305: U14.4 31.57,30.48
  Top 0.406: R18.2 R17.1 32.21,29.69 U14.4
N$37
  Top 0.406: U3.10 36.19,52.4 35.24,53.34 C21.2
N$38
  Top 0.406: U5.10 20.95,52.4 20,53.34 C17.2
N$39
  Top 0.406: U6.10 28.57,52.4 27.62,53.34 C19.2
N$40
  Top 0.406: U4.10 43.81,52.4 42.86,53.34 C23.2
PA2  (via drill 0.36)
  Top 0.254: H25.20 61.28,13.34 61.28,12.54 59.53,10.79 v59.05,10.79 | H7.1 7.3,9.84 21.43,9.84 21.91,10.32 23.97,10.32 26.19,8.1 30.96,8.1 32.7,6.35 | 32.7,6.35 32.93,6.12 U11.!CS!/NC/DAT3 | v39.53,5.71 38.89,6.35 32.7,6.35
  Bottom 0.254: v59.05,10.79 58.74,11.11 54.93,11.11 54.29,11.75 46.67,11.75 40.64,5.71 v39.53,5.71
PA3  (via drill 0.36)
  Top 0.254: H7.2 8.89,8.89 21.11,8.89 22.86,7.14 28.73,7.14 29.93,5.95 U11.CLK 29.93,5 v30.16,4.76 | H25.18 60.33,15.88 61.91,14.29 61.91,12.54 59.53,10.16 v58.42,10.16
  Bottom 0.254: v58.42,10.16 57.94,10.64 54.45,10.64 53.82,11.27 46.83,11.27 40.32,4.76 v30.16,4.76
PA4  (via drill 0.36)
  Top 0.254: H7.3 8.26,5.71 8.26,7.62 9.05,8.41 20.8,8.41 22.54,6.67 27.3,6.67 27.93,6.04 U11.MISO/DAT0 27.93,5.38 27.3,4.76 v27.3,4.45 | H25.16 60.33,18.41 61.91,16.83 61.91,14.92 62.55,14.29 62.55,12.54 59.53,9.53 v57.78,9.53
  Bottom 0.254: v57.78,9.53 57.15,10.16 53.98,10.16 53.34,10.79 46.99,10.79 40.32,4.13 27.62,4.13 v27.3,4.45
PA5
  Top 0.254: 5.71,8.26 7.62,8.26 8.73,9.37 21.43,9.37 23.18,7.62 30.48,7.62 31.93,6.17 U11.MOSI/CMD | 5.71,8.26 5.71,3.17 H7.4 | 5.71,8.26 5.71,20.32 6.35,20.95 7.46,20.95 10,18.41 H30.15
PA6  (via drill 0.36)
  Top 0.254: U6.4 33.63,53.05 34.29,52.39 34.29,48.9 v32.38,46.99 | v3.17,25.4 3.17,35.88 v3.81,36.51
  Top 0.406: H4.3 8.26,15.88 H30.17
  Bottom 0.254: H4.3 5.71,18.41 3.81,18.41 3.17,19.05 v3.17,25.4 | v3.81,36.51 4.45,37.15 4.45,40.32 11.75,47.62 25.4,47.62 26.04,46.99 v32.38,46.99
PA7  (via drill 0.36)
  Top 0.254: U5.4 26.01,53.05 26.67,52.39 26.67,48.9 v24.77,46.99 | v5.71,24.13 5.71,35.88 v5.08,36.51
  Top 0.406: H4.4 8.26,13.34 H30.19
  Bottom 0.254: H4.4 8.26,15.88 8.26,17.78 7.62,18.41 6.35,18.41 5.71,19.05 v5.71,24.13 | v5.08,36.51 5.08,40.01 12.06,46.99 v24.77,46.99
PB0  (via drill 0.36)
  Top 0.254: U13.2 40.32,5.15 v40.32,7.62 | v30.48,21.27 29.05,22.7 23.02,22.7 22.07,23.65 22.07,26.19 18.41,29.84 14.29,29.84 13.02,31.11 H30.5
  Top 0.406: U13.2 44.87,3.59 46.35,5.08 46.35,5.71 H21.3
  Bottom 0.254: v40.32,7.62 40.64,7.62 43.18,10.16 43.18,11.43 38.1,16.51 33.34,16.51 30.8,19.05 30.8,20.95 v30.48,21.27
PB1  (via drill 0.36)
  Top 0.254: 44.88,6.79 44.88,6.87 | v30.16,20.32 30.16,20.64 28.57,22.23 v20.95,22.23 | 46.83,8.73 43.02,8.73 v41.59,10.16 | H30.7 v13.02,28.57
  Top 0.406: H21.4 46.83,8.73 44.88,6.79 U13.3
  Bottom 0.254: v41.59,10.16 41.59,12.06 37.78,15.88 33.02,15.88 30.16,18.73 v30.16,20.32 | v13.02,28.57 19.37,22.23 v20.95,22.23
PB2  (via drill 0.36)
  Top 0.254: v42.86,13.65 45.24,11.27 48.42,11.27 H22.4 R6.2 52.56,10.3 50.48,12.38 50.48,16.83 50.96,17.3 50.96,30.96 52.39,32.38 56.52,32.38 57.78,33.66 H25.4 | H25.4 60.01,33.66 | v30.48,23.18 30,23.65 23.34,23.65 23.02,23.97 23.02,26.51 21.59,27.94 21.59,36.2 20.32,37.47 v20.32,38.1 | U8.23 32.59,20.2 v32.07,19.68 | v12.06,41.27 U2.12 | U9.5 55.2,53.61 v55.24,53.66 | v59.37,34.29 59.37,33.66 H25.4
  Bottom 0.254: v30.48,23.18 32.07,21.59 v32.07,19.68 33.97,17.78 38.73,17.78 v42.86,13.65 | v20.32,38.1 17.14,41.27 v12.06,41.27 | v55.24,53.66 55.24,41.27 59.37,37.15 v59.37,34.29
PB3  (via drill 0.36)
  Top 0.254: R7.2 H22.3 48.9,8.26 | 48.9,8.26 48.9,10.16 48.26,10.79 44.77,10.79 v42.86,12.7 | 48.9,8.26 53.02,8.26 53.34,8.57 53.34,10.16 50.96,12.54 50.96,16.51 51.44,16.99 51.44,30.48 52.07,31.11 H25.5 56.52,31.11 57.78,32.38 v58.74,32.38 | v30.48,22.23 29.53,23.18 23.18,23.18 22.54,23.81 22.54,26.35 21.11,27.78 21.11,35.72 v19.53,37.31 | U8.24 33.04,19.7 v32.07,18.73 | v11.27,40.64 12.7,40.64 12.99,40.94 U2.13 | U9.4 54.43,54.11 v54.61,54.29
  Bottom 0.254: v30.48,22.23 31.43,21.27 31.43,19.37 v32.07,18.73 33.66,17.14 38.42,17.14 v42.86,12.7 | v19.53,37.31 19.53,38.26 17.14,40.64 v11.27,40.64 | v54.61,54.29 54.61,40.96 58.74,36.83 v58.74,32.38
PB4  (via drill 0.36)
  Top 0.254: H10.3 65.41,33.66 65.41,35.56 58.1,42.86 53.66,42.86 50.48,46.04 v48.9,46.04 | H30.13 11.75,21.21 v11.75,22.23
  Bottom 0.254: v11.75,22.23 10.95,23.02 10.95,28.73 12.38,30.16 15.24,30.16 28.57,43.5 37.78,43.5 40.64,46.35 48.58,46.35 v48.9,46.04
PB5  (via drill 0.36)
  Top 0.254: H30.3 12.06,33.66 v13.97,31.75 | v64.14,37.78 63.82,37.78 58.26,43.34 53.82,43.34 50.48,46.67 v49.53,46.67
  Bottom 0.254: v13.97,31.75 16.19,31.75 28.42,43.97 37.62,43.97 40.48,46.83 49.37,46.83 v49.53,46.67 | H10.4 v64.14,37.78
PB6
  Top 0.406: H25.14 60.33,20.95 63.5,24.13 63.5,26.67 H10.1
PB7
  Top 0.406: H25.12 61.91,23.5 62.87,24.45 62.87,28.57 H10.2
PC4  (via drill 0.36)
  Top 0.254: U5.1 25.72,50.77 25.72,49.85 v25.4,49.53 | v37.15,44.77 46.35,44.77 48.58,42.55 49.21,42.55 51.44,40.32 v51.44,39.37 | v53.34,29.84 54.61,28.57 H25.7
  Bottom 0.254: v25.4,49.53 32.07,49.53 32.7,48.9 33.66,48.9 37.15,45.4 v37.15,44.77 | v51.44,39.37 51.44,31.75 v53.34,29.84
PC5  (via drill 0.36)
  Top 0.254: H16.3 v61.59,6.99 | v52.07,14.92 51.44,15.56 51.44,16.19 51.91,16.67 51.91,23.97 53.98,26.04 H25.9
  Bottom 0.254: v61.59,6.99 61.59,8.57 60.96,9.21 60.96,10.16 59.53,11.59 55.4,11.59 v52.07,14.92
PC6  (via drill 0.36)
  Top 0.254: H16.4 v61.59,9.53 | v52.07,15.88 52.39,16.19 52.39,22.86 53.02,23.5 H25.11
  Bottom 0.254: v61.59,9.53 61.59,10.16 59.69,12.06 55.88,12.06 v52.07,15.88
PC7  (via drill 0.36)
  Top 0.254: U3.1 40.96,50.77 40.96,49.85 40.32,49.21 v36.51,49.21 | v38.42,46.04 46.67,46.04 49.21,43.5 50.16,43.5 v53.34,40.32 | v52.07,29.84 v52.07,25.4 | H25.13 55.24,21.53 v55.24,22.23
  Bottom 0.254: v55.24,22.23 v52.07,25.4 | v53.34,40.32 51.44,40.32 50.8,39.69 50.8,31.11 v52.07,29.84 | v36.51,49.21 36.51,47.31 37.78,46.04 v38.42,46.04
PD0  (via drill 0.36)
  Top 0.254: U4.4 48.87,53.05 49.53,52.39 49.53,50.48 v49.69,50.32 | v40.8,41.75 40.64,41.91
  Top 0.406: H30.6 18.57,31.11 v19.05,30.64 | v44.77,40.01 42.86,41.91 40.64,41.91 40.32,41.91 40.01,42.23 30.8,42.23 v30.16,41.59 | H13.3 65.41,20.95 v65.41,25.4
  Bottom 0.254: v49.69,50.32 49.69,49.37 51.12,47.94 51.12,43.81 50.32,43.02 48.1,43.02 46.99,44.13 43.34,44.13 40.96,41.75 v40.8,41.75
  Bottom 0.406: v65.41,25.4 64.77,26.04 63.5,26.04 62.23,27.3 51.44,27.3 47.94,30.8 47.94,36.83 v44.77,40.01 | v30.16,41.59 29.21,40.64 28.89,40.64 19.05,30.8 v19.05,30.64
PD1  (via drill 0.36)
  Top 0.254: U3.4 41.25,53.05 41.91,52.39 41.91,49.05 v41.75,48.9 | 40.64,42.7 v40.8,42.7
  Top 0.406: v44.77,41.12 43.18,42.7 40.64,42.7 40.48,42.86 30.16,42.86 v28.89,41.59 | H13.4 64.14,25.4 65.41,26.67 v65.41,28.57 | H30.8 16.45,29.15 v16.51,29.21
  Bottom 0.254: v41.75,48.9 42.39,49.53 48.74,49.53 50.64,47.62 50.64,44.13 50.01,43.5 48.42,43.5 47.15,44.77 43.18,44.77 41.12,42.7 v40.8,42.7
  Bottom 0.406: v44.77,41.12 48.58,37.31 48.58,30.96 51.59,27.94 62.87,27.94 63.5,28.57 v65.41,28.57 | v28.89,41.59 v16.51,29.21
PD2
  Top 0.406: H30.10 15.88,26.04 13.97,27.94 13.97,29.21 13.34,29.84 9.53,29.84 8.89,30.48 8.89,33.02 H1.1
  Bottom 0.254: H1.1 7.56,35.5 J21.1
PD3
  Top 0.406: H30.12 15.88,23.5 13.97,25.4 13.97,26.67 13.34,27.3 9.53,27.3 8.26,28.57 8.26,31.11 H1.2
PD6  (via drill 0.36)
  Top 0.254: v54.61,17.14 54.61,18.35 H25.15
  Bottom 0.254: H16.1 62.39,3.65 62.39,10 59.85,12.54 56.36,12.54 54.61,14.29 v54.61,17.14
PD7  (via drill 0.36)
  Top 0.254: v55.24,15.56 54.93,15.88 H25.17
  Bottom 0.254: v55.24,15.56 55.24,14.45 56.67,13.02 60.01,13.02 62.87,10.16 62.87,5.71 H16.2
PE0  (via drill 0.36)
  Top 0.406: v45.88,41.12 43.5,43.5 29.53,43.5 27.62,41.59 v25.08,41.59 | v60.33,29.84 60.33,30.42 H25.6
  Bottom 0.406: v25.08,41.59 20,36.51 13.34,36.51 6.99,30.16 H1.3 | v60.33,29.84 59.05,28.57 51.75,28.57 49.21,31.11 49.21,37.78 v45.88,41.12
PE1
  Top 0.406: H30.14 15.24,20.95 13.97,22.23 13.97,24.13 13.34,24.77 9.53,24.77 H1.4
PE2
  Top 0.406: H4.1 9.53,19.68 13.97,19.68 15.24,18.41 H30.16
PE3
  Top 0.406: H4.2 9.53,17.14 13.97,17.14 15.24,15.88 H30.18
PE4  (via drill 0.36)
  Top 0.254: H30.9 v11.59,26.04 | v59.05,22.23 57.94,22.23 57.47,22.7 57.47,24.29 57.63,24.45 61.91,24.45 62.23,24.77 62.23,28.89 62.87,29.53 62.87,37.47 57.94,42.39 53.5,42.39 50.48,45.4 v48.26,45.4
  Bottom 0.254: v11.59,26.04 11.59,28.73 12.54,29.69 15.4,29.69 28.73,43.02 37.94,43.02 40.8,45.88 47.78,45.88 v48.26,45.4 | H13.1 65.41,15.88 65.41,17.78 64.77,18.41 62.87,18.41 v59.05,22.23
PE5  (via drill 0.36)
  Top 0.254: H30.11 v12.38,23.5 | v57.15,20.64 56.83,20.95 56.83,24.45 57.47,25.08 61.59,25.08 61.75,25.24 61.75,29.37 62.23,29.84 62.23,37.47 57.78,41.91 53.34,41.91 50.48,44.77 v48.9,44.77
  Bottom 0.254: v12.38,23.5 12.38,28.89 12.7,29.21 15.56,29.21 28.89,42.55 38.1,42.55 40.96,45.4 47.31,45.4 47.94,44.77 v48.9,44.77 | H13.2 60.64,17.14 v57.15,20.64
PF0  (via drill 0.36)
  Top 0.254: U6.1 33.34,50.77 33.34,49.85 v33.02,49.53 | v37.78,45.4 46.51,45.4 48.9,43.02 49.69,43.02 52.39,40.32 v52.39,39.05 | v57.15,30.48 59.05,28.57 H25.8
  Bottom 0.254: v52.39,39.05 52.7,38.73 52.7,32.7 54.93,30.48 v57.15,30.48 | v37.78,45.4 33.66,49.53 v33.02,49.53
PF3  (via drill 0.36)
  Top 0.254: U4.1 48.58,50.77 48.58,49.85 47.62,48.9 v46.35,48.9 | v49.69,44.13 50.48,44.13 v53.34,41.27 | v55.56,33.97 55.24,33.66 H25.3
  Bottom 0.254: v46.35,48.9 46.51,49.05 48.42,49.05 50.16,47.31 50.16,44.61 v49.69,44.13 | v53.34,41.27 55.56,39.05 v55.56,33.97
V1
  Top 1.27: H2.1 H2.2 H2.3 H2.4
  Bottom 0.61: 23.02,20.64 26.04,20.64 26.42,20.26 J3.2 | 23.02,20.64 22.23,20.64 | 22.23,20.64 11.11,20.64 | J2.2 23.75,19.91 23.02,20.64 | J1.2 21.84,20.26 22.23,20.64
  Bottom 1.016: H2.4 10.79,20.95 11.11,20.64 11.35,20.4 21.51,20.4
V2  (via drill 0.36)
  Top 0.61: 24.45,16.51 v25.08,16.51 v25.08,17.14 24.45,16.51 | 24.45,16.51 21.91,16.51 | 21.91,16.51 v21.27,16.51 v21.27,17.14 21.91,16.51
  Top 1.27: H5.2 H5.3 H5.4
  Bottom 0.61: J7.2 25.08,16.83 | 25.08,16.83 J6.2 | 25.08,16.83 v25.08,17.14 | v25.08,16.51 25.08,16.83 | v21.27,17.14 21.59,16.83 | 21.59,16.83 v21.27,16.51 | 21.59,16.83 J4.2
  Bottom 1.016: H5.4 6.03,13.02 7.62,13.02 11.43,16.83 21.59,16.83
  Bottom 1.27: H5.1 H5.2
V3
  Top 1.27: H8.1 H8.2 H8.3 H8.4
  Bottom 0.61: 23.75,13.02 26.04,13.02 26.42,13.4 J10.2 | J9.2 23.75,13.02 | 22.23,13.02 21.84,13.4 J8.2 21.84,14.22 20.95,13.34 | 22.23,13.02 23.75,13.02 | 22.23,13.02 15.88,13.02 15.56,12.7
  Bottom 1.016: H8.1 6.03,11.11 13.97,11.11 15.56,12.7 16.19,13.34 20.95,13.34 21.59,13.34
V4
  Top 1.27: H11.4 H11.3 H11.2 H11.1
  Bottom 0.61: 47.37,20.64 48.9,20.64 49.28,20.26 J11.2 49.53,19.37 | 47.37,20.64 45.09,20.64 44.7,20.26 J13.2 | J12.2 47.37,20.64
  Bottom 1.016: H11.1 66.67,25.08 65.72,24.13 59.05,24.13 55.88,20.95 51.75,20.95 50.16,19.37 49.53,19.37
V5  (via drill 0.36)
  Top 0.61: 46.67,16.51 v46.04,16.51 v46.04,15.88 46.67,16.51 | 46.67,16.51 48.9,16.51 | 48.9,16.51 v49.53,17.14 v49.53,16.51 48.9,16.51
  Top 1.27: H14.1 H14.2 | H14.3 H14.4
  Bottom 0.61: v46.04,15.88 v46.04,16.51 46.35,16.83 J15.2 J16.2 | J14.2 49.28,16.89 v49.53,17.14 49.53,16.83 v49.53,16.51
  Bottom 1.016: H14.1 65.09,13.02 63.18,13.02 56.67,19.53 52.23,19.53 49.53,16.83
  Bottom 1.27: H14.2 H14.3
V6
  Top 1.27: H17.4 H17.3 H17.2 H17.1
  Bottom 0.61: J19.2 44.7,13.4 45.09,13.02 47.37,13.02 | 47.37,13.02 48.9,13.02 49.28,13.4 J17.2 | J18.2 47.37,13.02 | J17.2 49.28,14.67 49.85,15.24 | J17.2 49.28,14.35 50.96,16.03
  Bottom 1.016: H17.4 65.09,11.11 63.18,11.11 56.04,18.26 52.86,18.26 49.85,15.24 49.53,14.92
VBAT  (via drill 0.36)
  Top 0.305: C2.1 27.3,24.62 U1.3 U1.2 | U9.8 U9.9 56.33,55.11 56.2,55.24 56.2,55.88 57.78,57.47 v57.78,58.1
  Top 0.61: C2.1 v27.62,24.45 v28.26,24.45 | 34.92,26.67 v34.45,27.15 | 34.29,26.99 v33.97,26.67 34.92,26.67 | 34.92,26.67 35.88,25.72 38.1,25.72 43.5,20.32 43.5,16.83 45.4,14.92 46.35,14.92 46.99,15.56 47.62,15.56 | 47.62,15.56 v48.26,15.56 v48.26,14.92 47.62,15.56 | 26.99,20.32 27.62,20.32 v27.94,20.64 v27.3,20.64 26.99,20.32 | 26.99,20.32 25.08,20.32 24.13,19.37 23.5,19.37 | 23.5,19.37 v22.86,19.37 v22.86,18.73 23.5,19.37
  Bottom 0.254: J20.1 53.47,53.53 53.66,53.34
  Bottom 0.305: v57.78,58.1 R1.2
  Bottom 0.61: J8.1 J4.1 22.61,18.48 | 22.61,18.48 J1.1 v22.86,19.37 | 57.41,59.95 R1.2 | 53.66,53.53 53.66,54.61 | 5.4,58.1 5.21,57.91 J5.1 | J11.1 J14.1 48.51,15.61 | 48.51,15.61 J17.1 48.51,14.67 v48.26,14.92 v48.26,15.56 48.32,15.61 48.51,15.61 | 22.61,18.48 v22.86,18.73
  Bottom 0.813: 57.41,59.95 57.41,59.63 53.66,55.88 53.66,54.61 53.66,53.34 53.66,43.81 51.12,41.27 47.15,41.27 46.2,42.23 44.45,42.23 40.64,38.42 v40.64,34.29 40.64,33.34 v34.45,27.15 v33.97,26.67 30.48,26.67 v28.26,24.45 | 5.4,58.1 9.53,62.23 55.88,62.23 57.78,60.33 R1.2 | v28.26,24.45 v27.62,24.45 | v27.3,20.64 v27.94,20.64 27.94,24.13 v28.26,24.45
  Bottom 1.778: H31.1 60.41,59.95 R1.2
  other vias: 39.37,34.29 40.01,34.29 40.64,33.66 40.01,33.66 39.37,33.66
  pour Top (no thermals): 36.2,33.34 37.94,33.34 39.21,34.61 40.96,34.61 40.96,32.38 36.2,32.38
  pour Bottom (no thermals): 39.05,32.38 39.05,34.61 40.96,34.61 40.96,32.38
  pour Top (no thermals): 59.05,67.31 59.05,60.33 arc90 60.33,59.05 71.12,59.05 71.12,67.31
VFET
  Top 1.27: D4.1 1.91,54.38 H19.2 H19.1 1.91,47.22 D3.1
  Bottom 0.61: J5.2 4.45,54.61 H19.2
VMOTOR  (via drill 0.36)
  Top 0.406: U4.8 45.38,54.95 | 45.38,54.95 v45.09,55.24 | 45.38,54.95 45.38,55.59 v45.09,55.88 | v45.09,55.88 v45.09,55.24 | v45.09,55.24 44.63,55.7 C31.1 44.77,55.56 v45.09,55.88 | U3.8 37.76,54.95 | 37.76,54.95 v37.47,55.24 | 37.76,54.95 37.76,55.59 v37.47,55.88 | v37.47,55.88 v37.47,55.24 | v37.47,55.24 37.01,55.7 C30.1 37.15,55.56 v37.47,55.88 | U6.8 30.14,54.95 | 30.14,54.95 v29.84,55.24 | 30.14,54.95 30.14,55.59 v29.84,55.88 | v29.84,55.88 v29.84,55.24 | v29.84,55.24 29.39,55.7 C28.1 29.53,55.56 v29.84,55.88 | U5.8 22.52,54.95 | 22.52,54.95 v22.23,55.24 | 22.52,54.95 22.52,55.59 v22.23,55.88 | v22.23,55.88 v22.23,55.24 | v22.23,55.24 21.77,55.7 C29.1 21.91,55.56 v22.23,55.88
  Top 1.27: C10.+ 16.97,58.59 v17.14,58.42 v17.78,57.78 | v17.78,57.78 v17.14,57.78 v16.51,58.42 | v17.78,57.78 v17.78,58.42 v17.14,59.05 v16.51,59.69 v16.51,58.42 | v16.51,59.05 v16.51,58.42 | v53.98,59.05 v54.61,59.69 v54.61,59.05 | v53.98,59.05 v53.34,58.42 v53.34,57.78 | v54.61,58.42 v53.98,57.78 v53.98,58.42 | v54.61,58.42 C11.+ | C11.+ v54.61,59.05 | v54.61,59.05 v53.98,59.05 | v54.61,58.42 v53.98,58.42 | v53.98,58.42 54.44,58.42 C11.+
  Bottom 0.254: 20,55.56 20.32,55.88 v22.23,55.88
  Bottom 0.406: v45.09,55.88 v37.47,55.88 v29.84,55.88 v22.23,55.88 21.75,55.88 21.59,55.72
  Bottom 0.61: 21.43,55.72 21.59,55.72 45.72,55.72 | J20.2 52.7,57.15 v53.34,57.78
  Bottom 1.676: v17.78,57.78 20,55.56 51.12,55.56 v53.34,57.78
  pour Bottom: 50.8,56.2 54.61,60.01 54.93,60.01 54.93,58.42 51.44,54.93 50.8,54.93
  pour Bottom: 20.32,56.2 16.51,60.01 16.19,60.01 16.19,58.42 19.68,54.93 20.32,54.93
XBEE.CONNECTED  (via drill 0.36)
  Top 0.254: U13.13 20.64,16.34 20.64,17.78 21.27,18.41 21.27,20 v19.68,21.59 | R4.1 6.49,40.46 v6.03,40.01 | v13.34,46.35 13.64,46.05 U2.7
  Bottom 0.254: v19.68,21.59 19.37,21.27 11.75,21.27 8.26,24.77 8.26,27.94 7.62,28.57 6.35,28.57 5.71,29.21 5.71,39.69 v6.03,40.01 12.38,46.35 v13.34,46.35

### Text on the board
tDocu: - | + | ~ | + | - | ~ | - | + | + | - | ~ | ~ | - | + | + | - | ~ | ~
bDocu: GND | Vout | M3 | M2 | M1 | M0 | VFET | Ext | Vout | VMOTOR | 5v | Vout | Vin | 1 | 0 | 3.3v | GND | 5v | Connected | Int.En | + | - | 0 | 12 | ~ | 1 | 13 | 2 | 14 | 3 | 15 | - | + | + | - | ~ | 4 | 16 | ~ | Batt | 5v | 3.3v | 3.3v | 5v | Batt | 5 | 17 | 0:3 | V | 12:15 | V | 6 | 18 | 4:7 | V | 16:19 | V | 7 | 19 | 8:11 | V | 20:23 | V | - | + | + | - | ~ | 8 | Robotics / BoosterPack | RxI | SCL | 20 | ~ | 9 | TxO | SDA | 21 | Cruz Monrreal II | 10 | AnomalousMaker.com | GND | GND | 22 | 11 | 3.3v | 3.3v | 23 | UART1 | I2C0